# EAGLE schematic master-v1.1 (EAGLE 6.2)

## Sheet 1 of 7
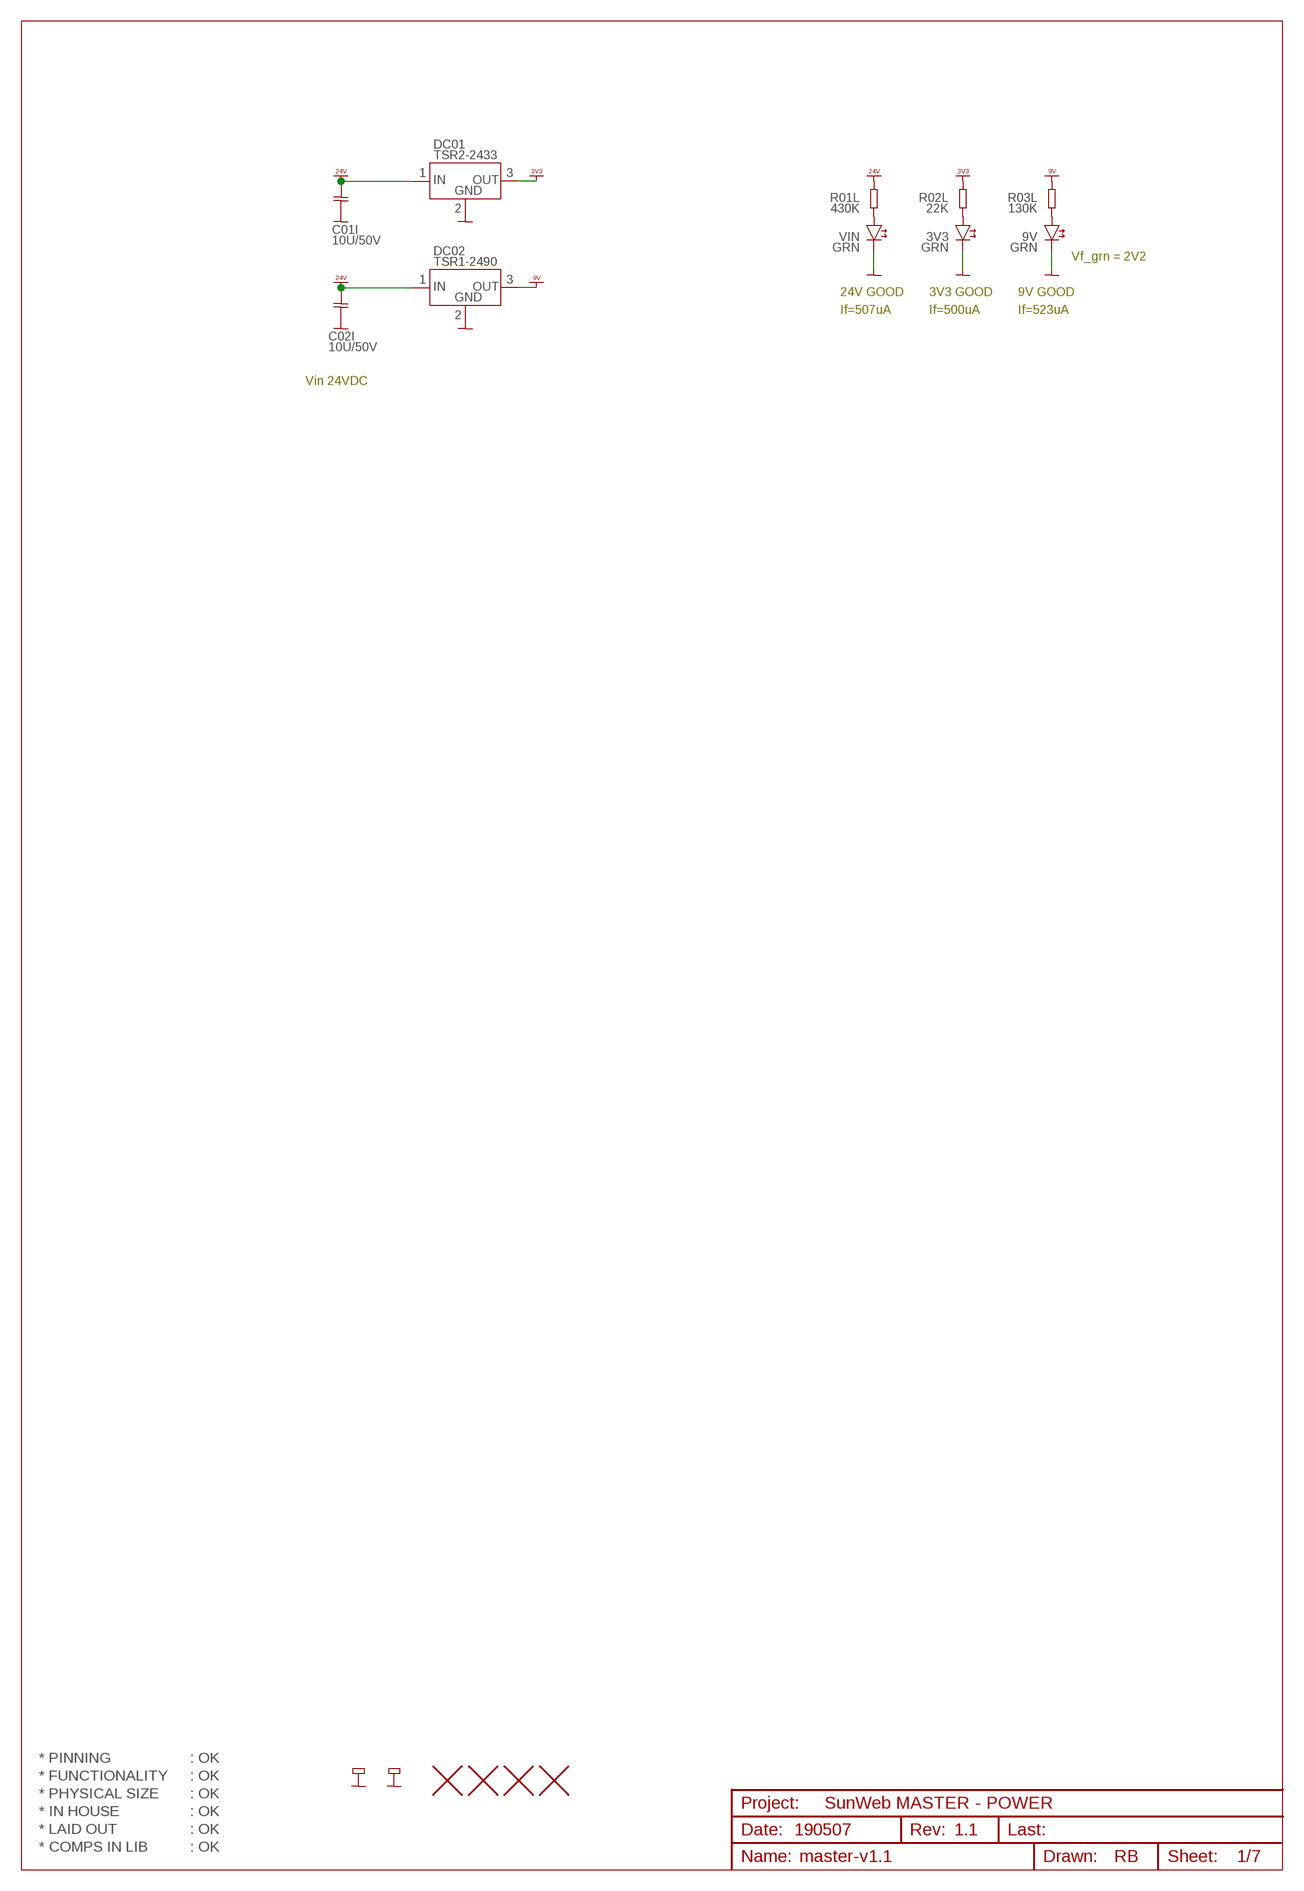
[diagram p0: schematic, sheet 1]

### Parts
3V3  GRN  LED_SMD_0603  [LED_SMD_0603]
9V  GRN  LED_SMD_0603  [LED_SMD_0603]
C01I  10U/50V  CAP1210  [CAP1210]
C02I  10U/50V  CAP1210  [CAP1210]
DC01  TSR2-2433  [TSR2-2433]
DC02  TSR1-2490  [TSR1-2490]
H1  HOLE_NPTH_3.2MM  [HOLE_NPTH_3.2MM]
H2  HOLE_NPTH_3.2MM  [HOLE_NPTH_3.2MM]
H3  HOLE_NPTH_3.2MM  [HOLE_NPTH_3.2MM]
H4  HOLE_NPTH_3.2MM  [HOLE_NPTH_3.2MM]
R01L  430K  RES0603  [RES0603]
R02L  22K  RES0603  [RES0603]
R03L  130K  RES0603  [RES0603]
TP1  PIN_GND  [HOLE_PTH_1.8MM_SQR]
TP2  PIN_GND  [HOLE_PTH_1.8MM_SQR]
VIN  GRN  LED_SMD_0603  [LED_SMD_0603]

### Nets
GND: 3V3.C 9V.C C01I.2 C02I.2 DC01.2(2.GND) DC02.2(2.GND) TP1.1 TP2.1 VIN.C ; also sheet 2,3,4,5,6,7
N$12: 9V.A R03L.2
N$28: 3V3.A R02L.2
N$29: R01L.2 VIN.A
VDD_3V3: DC01.3(3.OUT) R02L.1 ; supply symbol labelled VCC_3V3 ; also sheet 2,3,4,5,6,7
VDD_9V: DC02.3(3.OUT) R03L.1 ; supply symbol labelled VCC_9V ; also sheet 6
VDD_24V: C01I.1 C02I.1 DC01.1(1.IN) DC02.1(1.IN) R01L.1 ; supply symbol labelled VCC_24V ; also sheet 3

### Notes on the sheet
- Vf_grn = 2V2
- 24V GOOD | 3V3 GOOD | 9V GOOD
- If=507uA | If=500uA | If=523uA
- Vin 24VDC
- * PINNING | : OK
- * FUNCTIONALITY | : OK
- * PHYSICAL SIZE | : OK
- SunWeb MASTER - POWER
- * IN HOUSE | : OK
- * LAID OUT | : OK | 190507 | 1.1
- * COMPS IN LIB | : OK

## Sheet 2 of 7
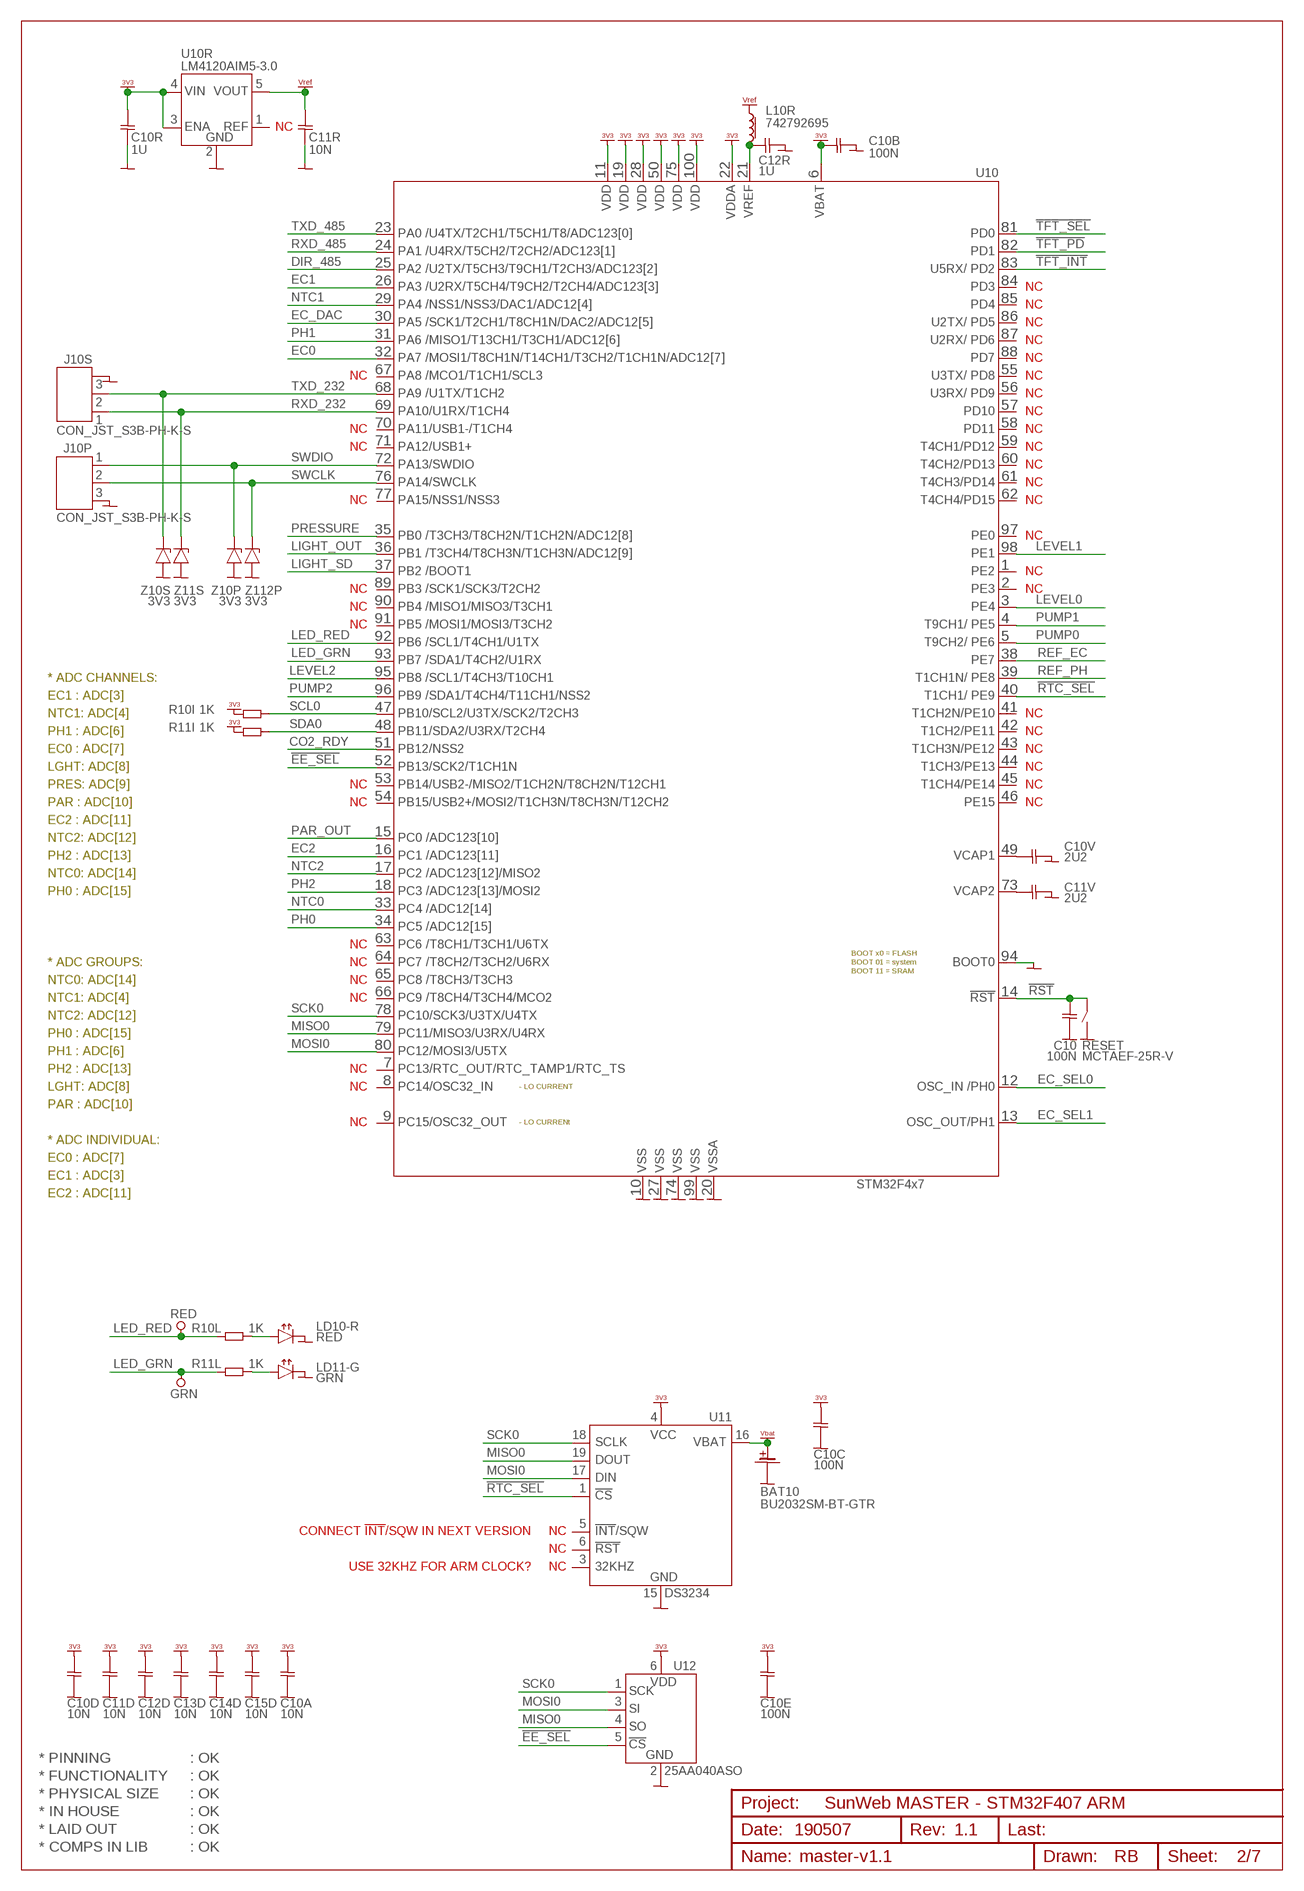
[diagram p1: schematic, sheet 2]

### Parts
BAT10  BU2032SM-BT-GTR  [BU2032SM-BT-GTR]
C10  100N  CAP0603  [CAP0603]
C10A  10N  CAP0603  [CAP0603]
C10B  100N  CAP0603  [CAP0603]
C10C  100N  CAP0603  [CAP0603]
C10D  10N  CAP0603  [CAP0603]
C10E  100N  CAP0603  [CAP0603]
C10R  1U  CAP0603  [CAP0603]
C10V  2U2  CAP0603  [CAP0603]
C11D  10N  CAP0603  [CAP0603]
C11R  10N  CAP0603  [CAP0603]
C11V  2U2  CAP0603  [CAP0603]
C12D  10N  CAP0603  [CAP0603]
C12R  1U  CAP0603  [CAP0603]
C13D  10N  CAP0603  [CAP0603]
C14D  10N  CAP0603  [CAP0603]
C15D  10N  CAP0603  [CAP0603]
GRN  PIN_TEST  [HOLE_PTH_0.8MM]
J10P  CON_JST_S3B-PH-K-S  [CON_JST_S3B-PH-K-S]
J10S  CON_JST_S3B-PH-K-S  [CON_JST_S3B-PH-K-S]
L10R  742792695  L_0603  [L_0603]
LD10-R  RED  LED_SMD_0603  [LED_SMD_0603]
LD11-G  GRN  LED_SMD_0603  [LED_SMD_0603]
R10I  1K  RES0603  [RES0603]
R10L  1K  RES0603  [RES0603]
R11I  1K  RES0603  [RES0603]
R11L  1K  RES0603  [RES0603]
RED  PIN_TEST  [HOLE_PTH_0.8MM]
RESET  MCTAEF-25R-V  SWITCH_PUSHBUTTON  [SWITCH_SMD_PBUTTON_2P]
U10  STM32F407VG  [LQFP100]
U10R  LM4120AIM5-3.0  [SOT23-5]
U11  DS3234  [SO20W]
U12  25AA040ASO  [SOT23-6]
Z10P  3V3  ZENER_SOD80  [ZENER_SOD80]
Z10S  3V3  ZENER_SOD80  [ZENER_SOD80]
Z11S  3V3  ZENER_SOD80  [ZENER_SOD80]
Z112P  3V3  ZENER_SOD80  [ZENER_SOD80]

### Nets
!EE_SEL: U10.52(52.PB13) U12.5(5.!CS)
!RST: C10.1 RESET.2(3-4) U10.14(14.!RST)
!RTC_SEL: U10.40(40.PE9) U11.1(1.CS)
!TFT_INT: U10.83(83.PD2) ; also sheet 3
!TFT_PD: U10.82(82.PD1) ; also sheet 3
!TFT_SEL: U10.81(81.PD0) ; also sheet 3
CO2_RDY: U10.51(51.PB12) ; also sheet 7
DIR_485: U10.25(25.PA2) ; also sheet 3
EC0: U10.32(32.PA7) ; also sheet 4
EC1: U10.26(26.PA3) ; also sheet 4
EC2: U10.16(16.PC1) ; also sheet 4
EC_DAC: U10.30(30.PA5) ; also sheet 4
EC_SEL0: U10.12(12.OSC_IN) ; also sheet 4
EC_SEL1: U10.13(13.OSC_OUT) ; also sheet 4
GND: BAT10.2.- C10.2 C10A.2 C10B.2 C10C.2 C10D.2 C10E.2 C10R.2 C10V.2 C11D.2 C11R.2 C11V.2 C12D.2 C12R.1 C13D.2 C14D.2 C15D.2 J10P.3 J10S.3 LD10-R.C LD11-G.C RESET.1(1-2) U10.10(10.VSS) U10.20(20.VSSA) U10.27(27.VSS) U10.74(74.VSS) U10.94(94.BOOT0) U10.99(99.VSS) U10R.2(2.GND) U11.2(15.GND) U11.7(15.GND) U11.8(15.GND) U11.9(15.GND) U11.10(15.GND) U11.11(15.GND) U11.12(15.GND) U11.13(15.GND) U11.14(15.GND) U11.15(15.GND) U12.2(2.GND) Z10P.1(A) Z10S.1(A) Z11S.1(A) Z112P.1(A) ; also sheet 1,3,4,5,6,7
LED_GRN: GRN.1 R11L.1 U10.93(93.PB7)
LED_RED: R10L.1 RED.1 U10.92(92.PB6)
LEVEL0: U10.3(3.PE4) ; also sheet 6
LEVEL1: U10.98(98.PE1) ; also sheet 6
LEVEL2: U10.95(95.PB8) ; also sheet 6
LIGHT_OUT: U10.36(36.PB1) ; also sheet 7
LIGHT_SD: U10.37(37.PB2) ; also sheet 7
MISO0: U10.79(79.PC11) U11.19(19.DOUT) U12.4(4.SO) ; also sheet 3
MOSI0: U10.80(80.PC12) U11.17(17.DIN) U12.3(3.SI) ; also sheet 3
N$1: C10V.1 U10.49(49.VCAP1)
N$4: C11V.1 U10.73(73.VCAP2)
N$38: LD11-G.A R11L.2
N$39: LD10-R.A R10L.2
NTC0: U10.33(33.PC4) ; also sheet 4
NTC1: U10.29(29.PA4) ; also sheet 4
NTC2: U10.17(17.PC2) ; also sheet 4
PAR_OUT: U10.15(15.PC0) ; also sheet 7
PH0: U10.34(34.PC5) ; also sheet 5
PH1: U10.31(31.PA6) ; also sheet 5
PH2: U10.18(18.PC3) ; also sheet 5
PRESSURE: U10.35(35.PB0) ; also sheet 7
PUMP0: U10.5(5.PE6) ; also sheet 6
PUMP1: U10.4(4.PE5) ; also sheet 6
PUMP2: U10.96(96.PB9) ; also sheet 6
REF_EC: U10.38(38.PE7) ; also sheet 4
REF_PH: U10.39(39.PE8) ; also sheet 5
RXD_232: J10S.1 U10.69(69.PA10) Z11S.2(C)
RXD_485: U10.24(24.PA1) ; also sheet 3
SCK0: U10.78(78.PC10) U11.18(18/20.SCLK) U11.20(18/20.SCLK) U12.1(1.SCK) ; also sheet 3
SCL0: R10I.2 U10.47(47.PB10) ; also sheet 7
SDA0: R11I.2 U10.48(48.PB11) ; also sheet 7
SWCLK: J10P.2 U10.76(76.PA14) Z112P.2(C)
SWDIO: J10P.1 U10.72(72.PA13) Z10P.2(C)
TXD_232: J10S.2 U10.68(68.PA9) Z10S.2(C)
TXD_485: U10.23(23.PA0) ; also sheet 3
VBAT: BAT10.1.+ U11.16(16.VBAT)
VCC_VREF: C11R.1 L10R.1 U10R.5(5.VOUT) ; also sheet 4,7
VDD_3V3: C10A.1 C10B.1 C10C.1 C10D.1 C10E.1 C10R.1 C11D.1 C12D.1 C13D.1 C14D.1 C15D.1 R10I.1 R11I.1 U10.6(6.VBAT) U10.11(11.VDD) U10.19(19.VDD) U10.22(22.VDDA) U10.28(28.VDD) U10.50(50.VDD) U10.75(75.VDD) U10.100(100.VDD) U10R.3(3.ENA) U10R.4(4.VIN) U11.4(4.VCC) U12.6(6.VDD) ; supply symbol labelled VCC_3V3 ; also sheet 1,3,4,5,6,7
VREF1: C12R.2 L10R.2 U10.21(21.VREF+)
Unconnected: U10.1(1.PE2) U10.2(2.PE3) U10.7(7.PC13) U10.8(8.PC14) U10.9(9.PC15) U10.41(41.PE10) U10.42(42.PE11) U10.43(43.PE12) U10.44(44.PE13) U10.45(45.PE14) U10.46(46.PE15) U10.53(53.PB14) U10.54(54.PB15) U10.55(55.PD8) U10.56(56.PD9) U10.57(57.PD10) U10.58(58.PD11) U10.59(59.PD12) U10.60(60.PD13) U10.61(61.PD14) U10.62(62.PD15) U10.63(63.PC6) U10.64(64.PC7) U10.65(65.PC8) U10.66(66.PC9) U10.67(67.PA8) U10.70(70.PA11) U10.71(71.PA12) U10.77(77.PA15) U10.84(84.PD3) U10.85(85.PD4) U10.86(86.PD5) U10.87(87.PD6) U10.88(88.PD7) U10.89(89.PB3) U10.90(90.PB4) U10.91(91.PB5) U10.97(97.PE0) U10R.1(1.REF) U11.3(3.32KHZ) U11.5(5.INT/SQW) U11.6(6.RST)

### Notes on the sheet
- NC
- NC
- NC
- NC
- NC
- NC
- NC | NC
- NC
- NC
- NC | NC
- NC | NC
- NC
- NC
- NC | NC
- NC
- NC
- NC | NC
- NC
- NC
- * ADC CHANNELS:
- EC1 : ADC[3]
- NTC1: ADC[4] | NC
- PH1 : ADC[6] | NC
- EC0 : ADC[7] | NC
- LGHT: ADC[8] | NC
- PRES: ADC[9] | NC | NC
- PAR : ADC[10] | NC | NC
- EC2 : ADC[11]
- NTC2: ADC[12]
- PH2 : ADC[13]
- NTC0: ADC[14]
- PH0 : ADC[15]
- NC
- * ADC GROUPS: | NC
- NTC0: ADC[14] | NC
- NTC1: ADC[4] | NC
- NTC2: ADC[12]
- PH0 : ADC[15]
- PH1 : ADC[6]
- PH2 : ADC[13] | NC
- LGHT: ADC[8] | NC
- PAR : ADC[10]
- NC
- * ADC INDIVIDUAL:
- EC0 : ADC[7]
- EC1 : ADC[3]
- EC2 : ADC[11]
- CONNECT !INT!/SQW IN NEXT VERSION | NC
- NC
- USE 32KHZ FOR ARM CLOCK? | NC
- * PINNING | : OK
- * FUNCTIONALITY | : OK
- * PHYSICAL SIZE | : OK
- SunWeb MASTER - STM32F407 ARM
- * IN HOUSE | : OK
- * LAID OUT | : OK | 190507 | 1.1
- * COMPS IN LIB | : OK

## Sheet 3 of 7
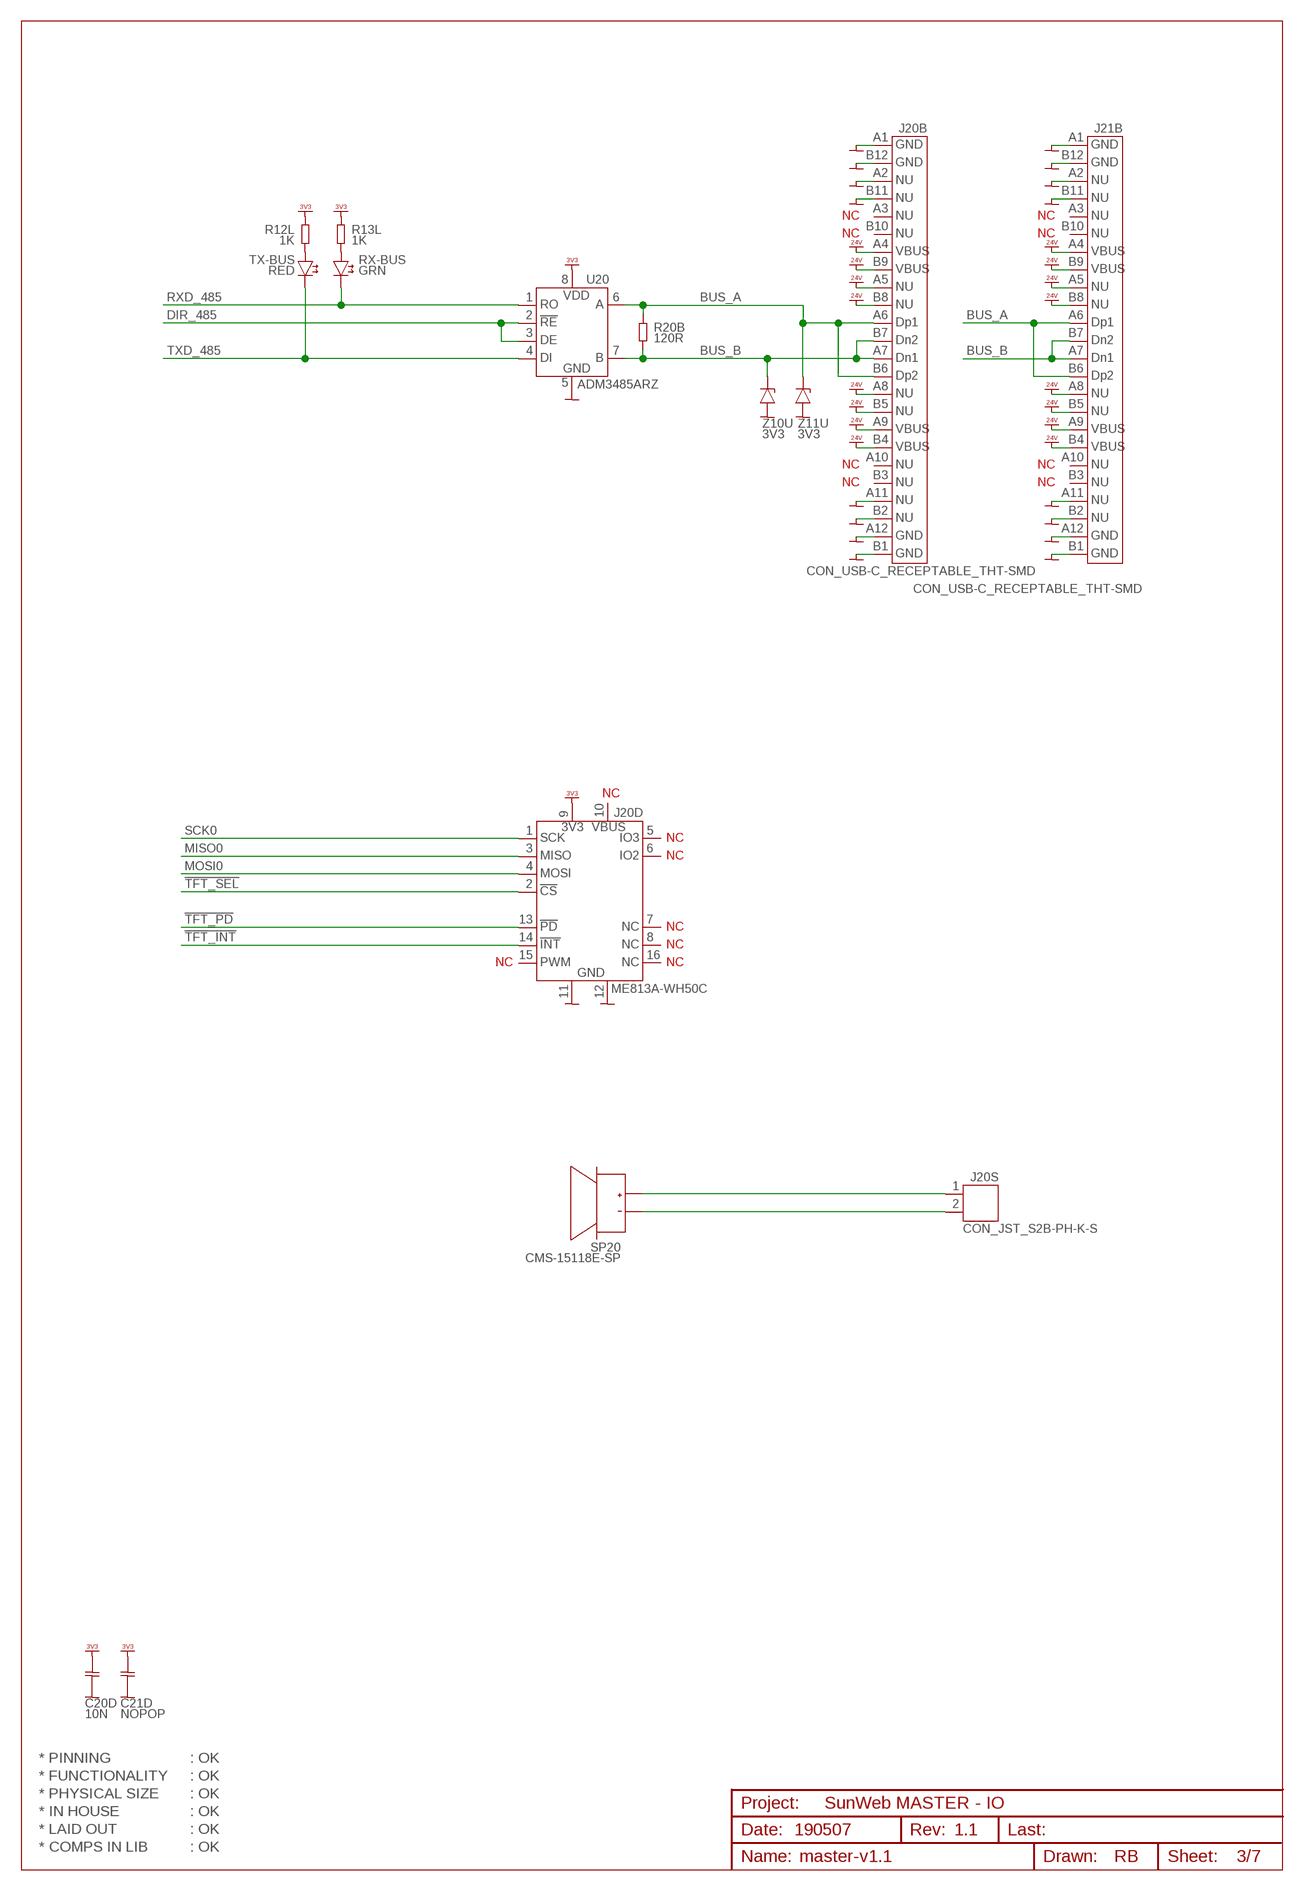
[diagram p2: schematic, sheet 3]

### Parts
C20D  10N  CAP0603  [CAP0603]
C21D  NOPOP  CAP1210  [CAP1210]
J20B  CON_USB-C_RECEPTABLE_THT-SMD  [CON_USB-C_RECEPTABLE_THT-SMD]
J20D  ME813A-WH50C  [ME813A-WH50C]
J20S  CON_JST_S2B-PH-K-S  [CON_JST_S2B-PH-K-S]
J21B  CON_USB-C_RECEPTABLE_THT-SMD  [CON_USB-C_RECEPTABLE_THT-SMD]
R12L  1K  RES0603  [RES0603]
R13L  1K  RES0603  [RES0603]
R20B  120R  RES0603  [RES0603]
RX-BUS  GRN  LED_SMD_0603  [LED_SMD_0603]
SP20  CMS-15118E-SP  [CMS-15118E-SP]
TX-BUS  RED  LED_SMD_0603  [LED_SMD_0603]
U20  ADM3485ARZ  [SO8]
Z10U  3V3  ZENER_SOD80  [ZENER_SOD80]
Z11U  3V3  ZENER_SOD80  [ZENER_SOD80]

### Nets
!TFT_INT: J20D.14(14.!INT) ; also sheet 2
!TFT_PD: J20D.13(13.!PD) ; also sheet 2
!TFT_SEL: J20D.2(2.!CS) ; also sheet 2
BUS_A: J20B.A6(A6.DP1) J20B.B6(B6.DP2) J21B.A6(A6.DP1) J21B.B6(B6.DP2) R20B.1 U20.6(6.A) Z11U.2(C)
BUS_B: J20B.A7(A7.DN1) J20B.B7(B7.DN2) J21B.A7(A7.DN1) J21B.B7(B7.DN2) R20B.2 U20.7(7.B) Z10U.2(C)
DIR_485: U20.2(2.!RE) U20.3(3.DE) ; also sheet 2
GND: C20D.2 C21D.2 J20B.A1(A1.GND) J20B.A2(A2.NU) J20B.A11(A11.NU) J20B.A12(A12.GND) J20B.B1(B1.GND) J20B.B2(B2.NU) J20B.B11(B11.NU) J20B.B12(B12.GND) J20D.11(11.GND) J20D.12(12.GND) J21B.A1(A1.GND) J21B.A2(A2.NU) J21B.A11(A11.NU) J21B.A12(A12.GND) J21B.B1(B1.GND) J21B.B2(B2.NU) J21B.B11(B11.NU) J21B.B12(B12.GND) U20.5(5.GND) Z10U.1(A) Z11U.1(A) ; also sheet 1,2,4,5,6,7
MISO0: J20D.3(3.MISO) ; also sheet 2
MOSI0: J20D.4(4.MOSI) ; also sheet 2
N$21: J20S.1 SP20.+
N$22: J20S.2 SP20.-
N$152: R13L.2 RX-BUS.A
N$153: R12L.2 TX-BUS.A
RXD_485: RX-BUS.C U20.1(1.RO) ; also sheet 2
SCK0: J20D.1(1.SCK) ; also sheet 2
TXD_485: TX-BUS.C U20.4(4.DI) ; also sheet 2
VDD_3V3: C20D.1 C21D.1 J20D.9(9.3V3_IN) R12L.1 R13L.1 U20.8(8.VDD) ; supply symbol labelled VCC_3V3 ; also sheet 1,2,4,5,6,7
VDD_24V: J20B.A4(A4.VBUS) J20B.A5(A5.NU) J20B.A8(A8.NU) J20B.A9(A9.VBUS) J20B.B4(B4.VBUS) J20B.B5(B5.NU) J20B.B8(B8.NU) J20B.B9(B9.VBUS) J21B.A4(A4.VBUS) J21B.A5(A5.NU) J21B.A8(A8.NU) J21B.A9(A9.VBUS) J21B.B4(B4.VBUS) J21B.B5(B5.NU) J21B.B8(B8.NU) J21B.B9(B9.VBUS) ; supply symbol labelled VCC_24V ; also sheet 1
Unconnected: J20B.A3(A3.NU) J20B.A10(A10.NU) J20B.B3(B3.NU) J20B.B10(B10.NU) J20D.5(5.IO3) J20D.6(6.IO2) J20D.7(7.NC) J20D.8(8.NC) J20D.10(10.VBUS) J20D.15(15.PWM) J20D.16(16.NC) J21B.A3(A3.NU) J21B.A10(A10.NU) J21B.B3(B3.NU) J21B.B10(B10.NU)

### Notes on the sheet
- NC | NC
- NC | NC
- NC | NC
- NC | NC
- NC
- NC
- NC
- NC
- NC
- NC | NC
- * PINNING | : OK
- * FUNCTIONALITY | : OK
- * PHYSICAL SIZE | : OK
- SunWeb MASTER - IO
- * IN HOUSE | : OK
- * LAID OUT | : OK | 190507 | 1.1
- * COMPS IN LIB | : OK

## Sheet 4 of 7
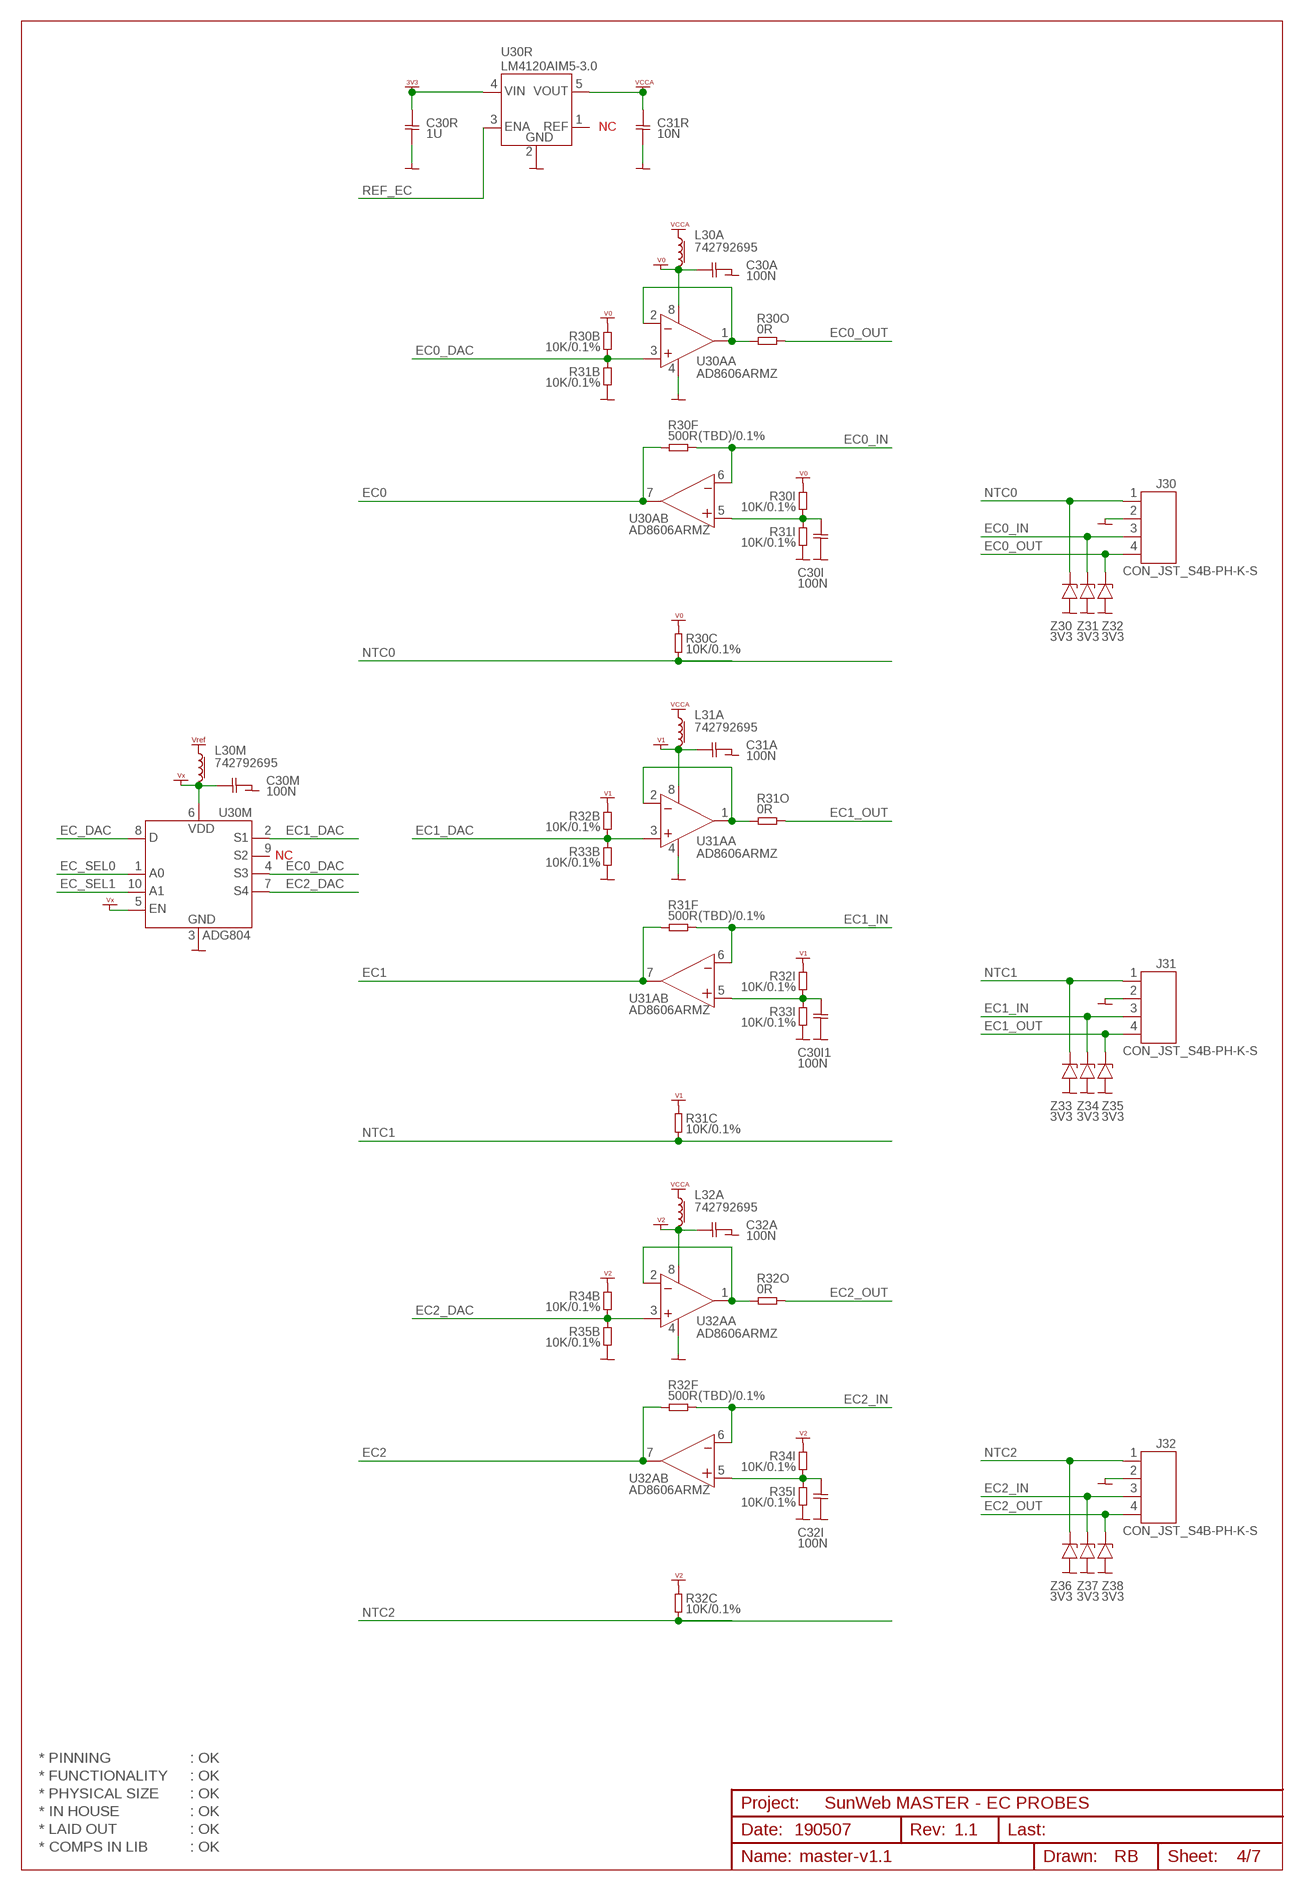
[diagram p3: schematic, sheet 4]

### Parts
C30A  100N  CAP0603  [CAP0603]
C30I  100N  CAP0603  [CAP0603]
C30I1  100N  CAP0603  [CAP0603]
C30M  100N  CAP0603  [CAP0603]
C30R  1U  CAP0603  [CAP0603]
C31A  100N  CAP0603  [CAP0603]
C31R  10N  CAP0603  [CAP0603]
C32A  100N  CAP0603  [CAP0603]
C32I  100N  CAP0603  [CAP0603]
J30  CON_JST_S4B-PH-K-S  [CON_JST_S4B-PH-K-S]
J31  CON_JST_S4B-PH-K-S  [CON_JST_S4B-PH-K-S]
J32  CON_JST_S4B-PH-K-S  [CON_JST_S4B-PH-K-S]
L30A  742792695  L_0603  [L_0603]
L30M  742792695  L_0603  [L_0603]
L31A  742792695  L_0603  [L_0603]
L32A  742792695  L_0603  [L_0603]
R30B  10K/0.1%  RES0603  [RES0603]
R30C  10K/0.1%  RES0603  [RES0603]
R30F  500R(TBD)/0.1%  RES0603  [RES0603]
R30I  10K/0.1%  RES0603  [RES0603]
R30O  0R  RES0603  [RES0603]
R31B  10K/0.1%  RES0603  [RES0603]
R31C  10K/0.1%  RES0603  [RES0603]
R31F  500R(TBD)/0.1%  RES0603  [RES0603]
R31I  10K/0.1%  RES0603  [RES0603]
R31O  0R  RES0603  [RES0603]
R32B  10K/0.1%  RES0603  [RES0603]
R32C  10K/0.1%  RES0603  [RES0603]
R32F  500R(TBD)/0.1%  RES0603  [RES0603]
R32I  10K/0.1%  RES0603  [RES0603]
R32O  0R  RES0603  [RES0603]
R33B  10K/0.1%  RES0603  [RES0603]
R33I  10K/0.1%  RES0603  [RES0603]
R34B  10K/0.1%  RES0603  [RES0603]
R34I  10K/0.1%  RES0603  [RES0603]
R35B  10K/0.1%  RES0603  [RES0603]
R35I  10K/0.1%  RES0603  [RES0603]
U30A  AD8606ARMZ  [MSOP8]
U30M  ADG804  [MSOP10]
U30R  LM4120AIM5-3.0  [SOT23-5]
U31A  AD8606ARMZ  [MSOP8]
U32A  AD8606ARMZ  [MSOP8]
Z30  3V3  ZENER_SOD80  [ZENER_SOD80]
Z31  3V3  ZENER_SOD80  [ZENER_SOD80]
Z32  3V3  ZENER_SOD80  [ZENER_SOD80]
Z33  3V3  ZENER_SOD80  [ZENER_SOD80]
Z34  3V3  ZENER_SOD80  [ZENER_SOD80]
Z35  3V3  ZENER_SOD80  [ZENER_SOD80]
Z36  3V3  ZENER_SOD80  [ZENER_SOD80]
Z37  3V3  ZENER_SOD80  [ZENER_SOD80]
Z38  3V3  ZENER_SOD80  [ZENER_SOD80]

### Nets
EC0: R30F.2 U30A.7(B:7.OUT) ; also sheet 2
EC0_DAC: R30B.2 R31B.1 U30A.3(A:3.IN+) U30M.4(4.S3)
EC0_IN: J30.3 R30F.1 U30A.6(B:6.IN-) Z31.2(C)
EC0_OUT: J30.4 R30O.1 Z32.2(C)
EC1: R31F.2 U31A.7(B:7.OUT) ; also sheet 2
EC1_DAC: R32B.2 R33B.1 U30M.2(2.S1) U31A.3(A:3.IN+)
EC1_IN: J31.3 R31F.1 U31A.6(B:6.IN-) Z34.2(C)
EC1_OUT: J31.4 R31O.1 Z35.2(C)
EC2: R32F.2 U32A.7(B:7.OUT) ; also sheet 2
EC2_DAC: R34B.2 R35B.1 U30M.7(7.S4) U32A.3(A:3.IN+)
EC2_IN: J32.3 R32F.1 U32A.6(B:6.IN-) Z37.2(C)
EC2_OUT: J32.4 R32O.1 Z38.2(C)
EC30_BUF: R30O.2 U30A.1(A:1.OUT) U30A.2(A:2.IN-)
EC30_BUF1: R31O.2 U31A.1(A:1.OUT) U31A.2(A:2.IN-)
EC30_BUF2: R32O.2 U32A.1(A:1.OUT) U32A.2(A:2.IN-)
EC_DAC: U30M.8(8.D) ; also sheet 2
EC_SEL0: U30M.1(1.A0) ; also sheet 2
EC_SEL1: U30M.10(10.A1) ; also sheet 2
GND: C30A.2 C30I1.1 C30I.1 C30M.2 C30R.2 C31A.2 C31R.2 C32A.2 C32I.1 J30.2 J31.2 J32.2 R31B.2 R31I.2 R33B.2 R33I.2 R35B.2 R35I.2 U30A.4(A:4.V-) U30M.3(3.GND) U30R.2(2.GND) U31A.4(A:4.V-) U32A.4(A:4.V-) Z30.1(A) Z31.1(A) Z32.1(A) Z33.1(A) Z34.1(A) Z35.1(A) Z36.1(A) Z37.1(A) Z38.1(A) ; also sheet 1,2,3,5,6,7
N$5: C30I1.2 R32I.2 R33I.1 U31A.5(B:5.IN+)
N$6: C32I.2 R34I.2 R35I.1 U32A.5(B:5.IN+)
N$19: C30I.2 R30I.2 R31I.1 U30A.5(B:5.IN+)
NTC0: J30.1 R30C.2 Z30.2(C) ; also sheet 2
NTC1: J31.1 R31C.2 Z33.2(C) ; also sheet 2
NTC2: J32.1 R32C.2 Z36.2(C) ; also sheet 2
REF_EC: U30R.3(3.ENA) ; also sheet 2
V0: C30A.1 L30A.2 R30B.1 R30C.1 R30I.1 U30A.8(A:8.V+)
V1: C31A.1 L31A.2 R31C.1 R32B.1 R32I.1 U31A.8(A:8.V+)
V2: C32A.1 L32A.2 R32C.1 R34B.1 R34I.1 U32A.8(A:8.V+)
VCC_VREF: L30M.1 ; also sheet 2,7
VCCA: C31R.1 L30A.1 L31A.1 L32A.1 U30R.5(5.VOUT)
VDD_3V3: C30R.1 U30R.4(4.VIN) ; supply symbol labelled VCC_3V3 ; also sheet 1,2,3,5,6,7
VX: C30M.1 L30M.2 U30M.5(5.EN) U30M.6(6.VDD)
Unconnected: U30M.9(9.S2) U30R.1(1.REF)

### Notes on the sheet
- NC
- NC
- * PINNING | : OK
- * FUNCTIONALITY | : OK
- * PHYSICAL SIZE | : OK
- SunWeb MASTER - EC PROBES
- * IN HOUSE | : OK
- * LAID OUT | : OK | 190507 | 1.1
- * COMPS IN LIB | : OK

## Sheet 5 of 7
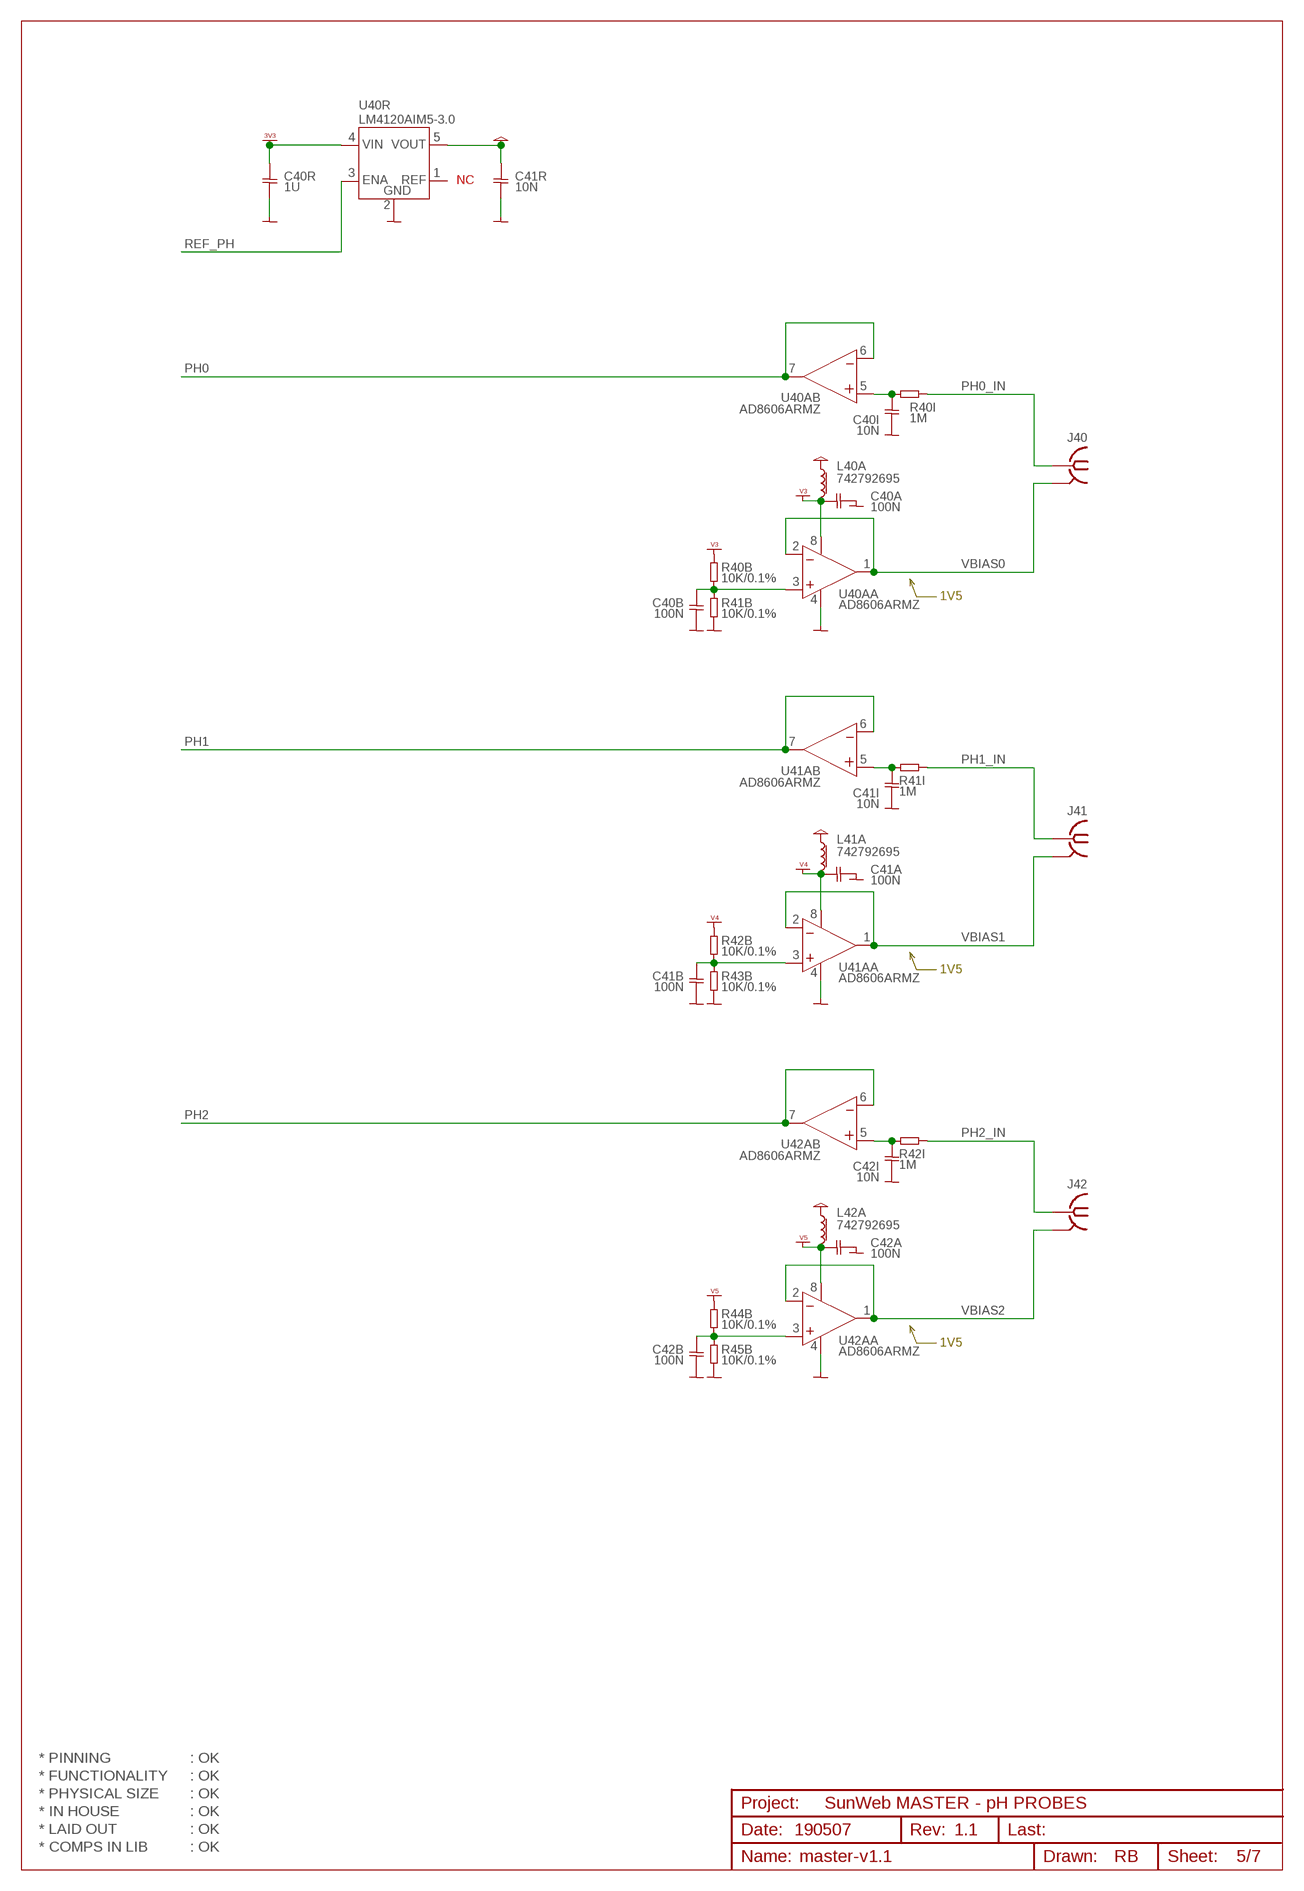
[diagram p4: schematic, sheet 5]

### Parts
C40A  100N  CAP0603  [CAP0603]
C40B  100N  CAP0603  [CAP0603]
C40I  10N  CAP0603  [CAP0603]
C40R  1U  CAP0603  [CAP0603]
C41A  100N  CAP0603  [CAP0603]
C41B  100N  CAP0603  [CAP0603]
C41I  10N  CAP0603  [CAP0603]
C41R  10N  CAP0603  [CAP0603]
C42A  100N  CAP0603  [CAP0603]
C42B  100N  CAP0603  [CAP0603]
C42I  10N  CAP0603  [CAP0603]
J40  CON_SMA_EDGE_PCB_WIDE_4_CPW  [SMA_LAUNCH_WIDE_4LAYER_CPW]
J41  CON_SMA_EDGE_PCB_WIDE_4_CPW  [SMA_LAUNCH_WIDE_4LAYER_CPW]
J42  CON_SMA_EDGE_PCB_WIDE_4_CPW  [SMA_LAUNCH_WIDE_4LAYER_CPW]
L40A  742792695  L_0603  [L_0603]
L41A  742792695  L_0603  [L_0603]
L42A  742792695  L_0603  [L_0603]
R40B  10K/0.1%  RES0603  [RES0603]
R40I  1M  RES0603  [RES0603]
R41B  10K/0.1%  RES0603  [RES0603]
R41I  1M  RES0603  [RES0603]
R42B  10K/0.1%  RES0603  [RES0603]
R42I  1M  RES0603  [RES0603]
R43B  10K/0.1%  RES0603  [RES0603]
R44B  10K/0.1%  RES0603  [RES0603]
R45B  10K/0.1%  RES0603  [RES0603]
U40A  AD8606ARMZ  [MSOP8]
U40R  LM4120AIM5-3.0  [SOT23-5]
U41A  AD8606ARMZ  [MSOP8]
U42A  AD8606ARMZ  [MSOP8]

### Nets
!PH0_OFF: C40B.2 R40B.2 R41B.1 U40A.3(A:3.IN+)
!PH1_OFF: C41B.2 R42B.2 R43B.1 U41A.3(A:3.IN+)
!PH2_OFF: C42B.2 R44B.2 R45B.1 U42A.3(A:3.IN+)
GND: C40A.1 C40B.1 C40I.1 C40R.2 C41A.1 C41B.1 C41I.1 C41R.2 C42A.1 C42B.1 C42I.1 R41B.2 R43B.2 R45B.2 U40A.4(A:4.V-) U40R.2(2.GND) U41A.4(A:4.V-) U42A.4(A:4.V-) ; also sheet 1,2,3,4,6,7
N$9: C41I.2 R41I.2 U41A.5(B:5.IN+)
N$17: C42I.2 R42I.2 U42A.5(B:5.IN+)
N$20: C40I.2 R40I.2 U40A.5(B:5.IN+)
PH0: U40A.6(B:6.IN-) U40A.7(B:7.OUT) ; also sheet 2
PH0_IN: J40.PIN R40I.1
PH1: U41A.6(B:6.IN-) U41A.7(B:7.OUT) ; also sheet 2
PH1_IN: J41.PIN R41I.1
PH2: U42A.6(B:6.IN-) U42A.7(B:7.OUT) ; also sheet 2
PH2_IN: J42.PIN R42I.1
REF_PH: U40R.3(3.ENA) ; also sheet 2
V3: C40A.2 L40A.2 R40B.1 U40A.8(A:8.V+)
V4: C41A.2 L41A.2 R42B.1 U41A.8(A:8.V+)
V5: C42A.2 L42A.2 R44B.1 U42A.8(A:8.V+)
VBIAS0: J40.GND1(GND) J40.GND2(GND) J40.GND3(GND) J40.GND4(GND) J40.GND5(GND) U40A.1(A:1.OUT) U40A.2(A:2.IN-)
VBIAS1: J41.GND1(GND) J41.GND2(GND) J41.GND3(GND) J41.GND4(GND) J41.GND5(GND) U41A.1(A:1.OUT) U41A.2(A:2.IN-)
VBIAS2: J42.GND1(GND) J42.GND2(GND) J42.GND3(GND) J42.GND4(GND) J42.GND5(GND) U42A.1(A:1.OUT) U42A.2(A:2.IN-)
VCC: C41R.1 L40A.1 L41A.1 L42A.1 U40R.5(5.VOUT)
VDD_3V3: C40R.1 U40R.4(4.VIN) ; supply symbol labelled VCC_3V3 ; also sheet 1,2,3,4,6,7
Unconnected: U40R.1(1.REF)

### Notes on the sheet
- NC
- 1V5
- 1V5
- 1V5
- * PINNING | : OK
- * FUNCTIONALITY | : OK
- * PHYSICAL SIZE | : OK
- SunWeb MASTER - pH PROBES
- * IN HOUSE | : OK
- * LAID OUT | : OK | 190507 | 1.1
- * COMPS IN LIB | : OK

## Sheet 6 of 7
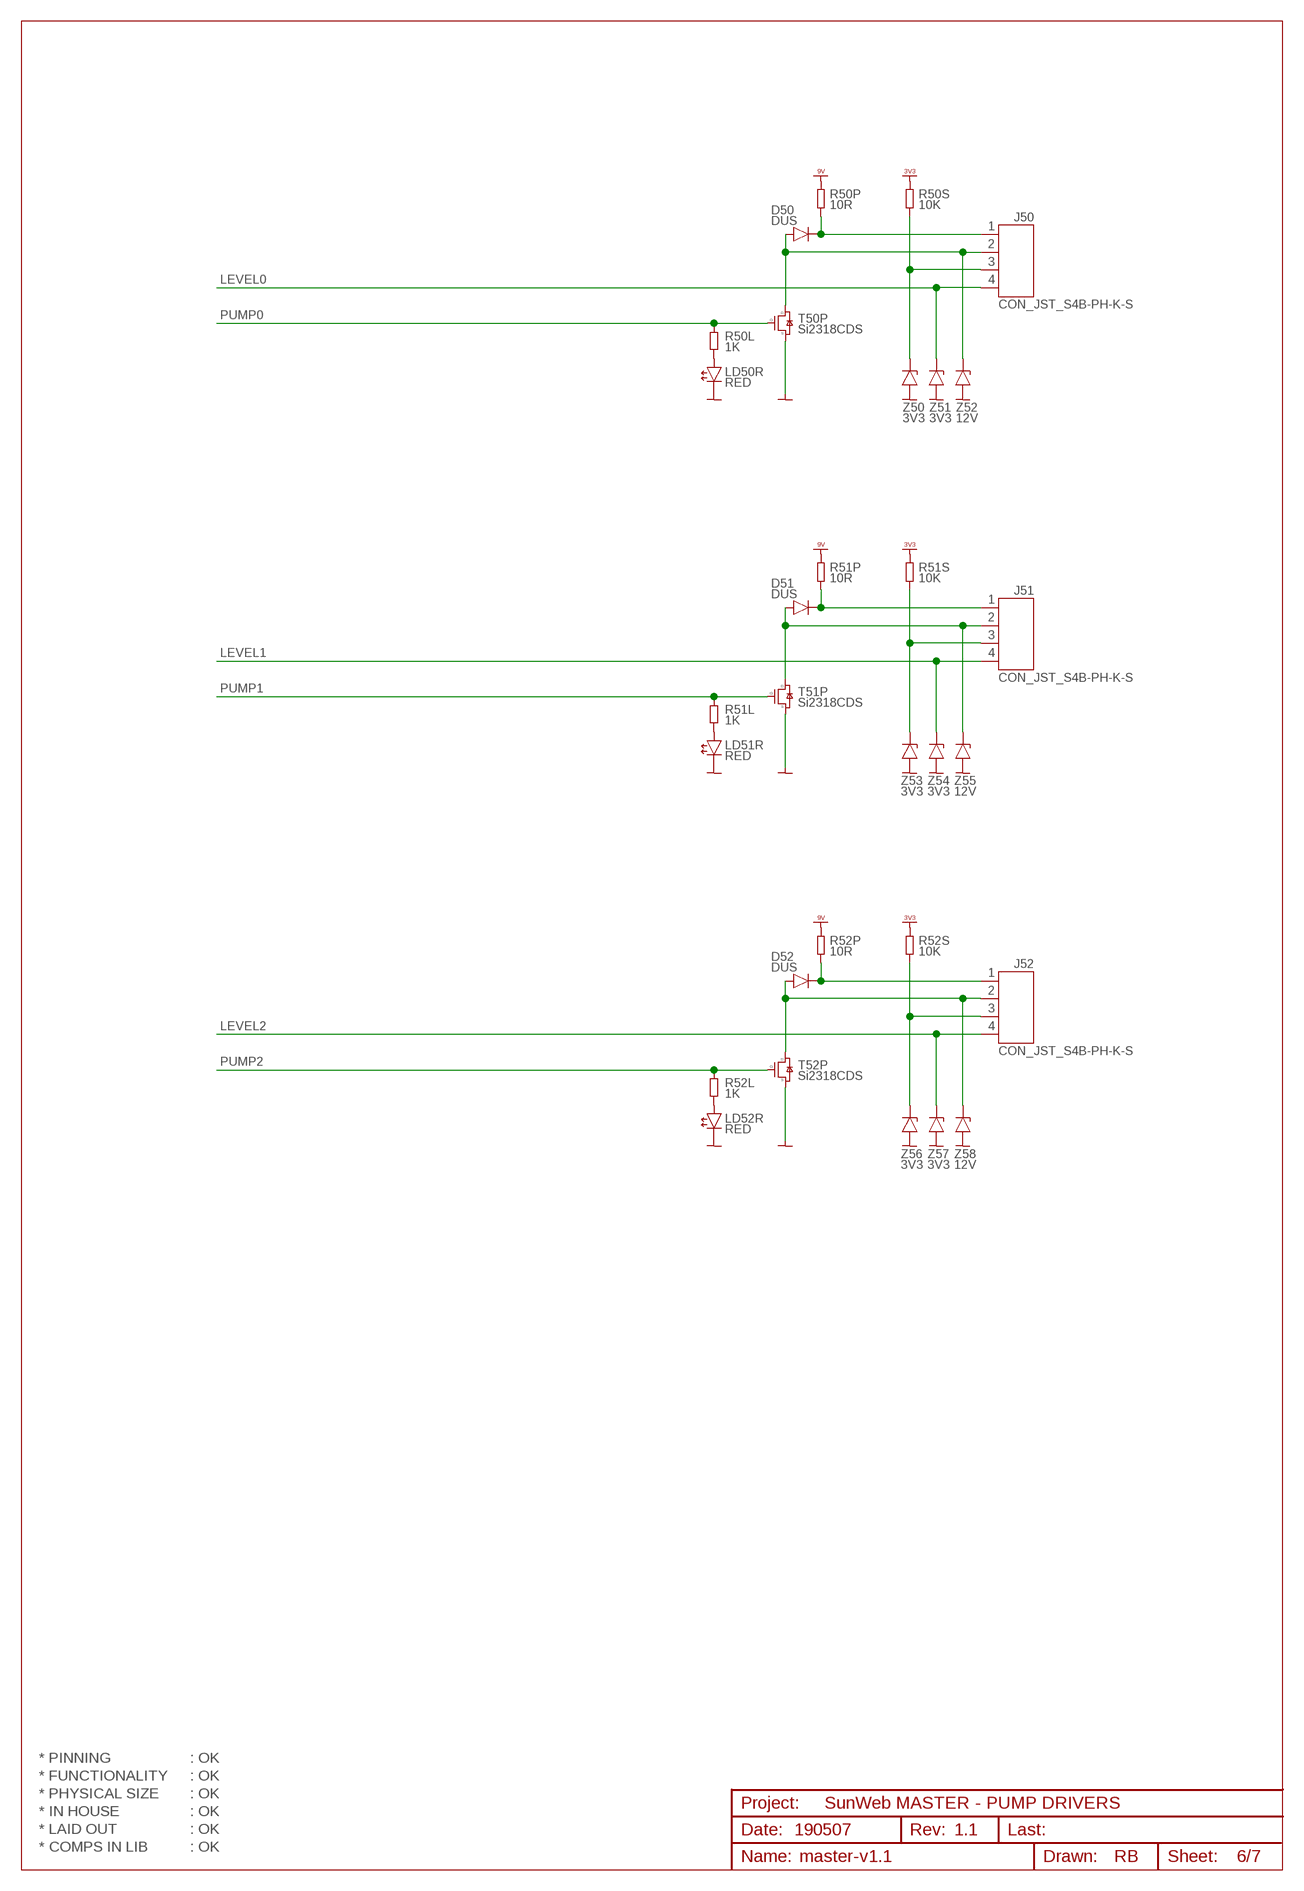
[diagram p5: schematic, sheet 6]

### Parts
D50  DUS  DIODE_1N4148WS  [DIODE_SOD323]
D51  DUS  DIODE_1N4148WS  [DIODE_SOD323]
D52  DUS  DIODE_1N4148WS  [DIODE_SOD323]
J50  CON_JST_S4B-PH-K-S  [CON_JST_S4B-PH-K-S]
J51  CON_JST_S4B-PH-K-S  [CON_JST_S4B-PH-K-S]
J52  CON_JST_S4B-PH-K-S  [CON_JST_S4B-PH-K-S]
LD50R  RED  LED_SMD_0603  [LED_SMD_0603]
LD51R  RED  LED_SMD_0603  [LED_SMD_0603]
LD52R  RED  LED_SMD_0603  [LED_SMD_0603]
R50L  1K  RES0603  [RES0603]
R50P  10R  RES0805  [RES0805]
R50S  10K  RES0603  [RES0603]
R51L  1K  RES0603  [RES0603]
R51P  10R  RES0805  [RES0805]
R51S  10K  RES0603  [RES0603]
R52L  1K  RES0603  [RES0603]
R52P  10R  RES0805  [RES0805]
R52S  10K  RES0603  [RES0603]
T50P  Si2318CDS  NFET_SOT23  [NFET_SOT23]
T51P  Si2318CDS  NFET_SOT23  [NFET_SOT23]
T52P  Si2318CDS  NFET_SOT23  [NFET_SOT23]
Z50  3V3  ZENER_SOD80  [ZENER_SOD80]
Z51  3V3  ZENER_SOD80  [ZENER_SOD80]
Z52  12V  ZENER_SOD80  [ZENER_SOD80]
Z53  3V3  ZENER_SOD80  [ZENER_SOD80]
Z54  3V3  ZENER_SOD80  [ZENER_SOD80]
Z55  12V  ZENER_SOD80  [ZENER_SOD80]
Z56  3V3  ZENER_SOD80  [ZENER_SOD80]
Z57  3V3  ZENER_SOD80  [ZENER_SOD80]
Z58  12V  ZENER_SOD80  [ZENER_SOD80]

### Nets
GND: LD50R.C LD51R.C LD52R.C T50P.2(S2) T51P.2(S2) T52P.2(S2) Z50.1(A) Z51.1(A) Z52.1(A) Z53.1(A) Z54.1(A) Z55.1(A) Z56.1(A) Z57.1(A) Z58.1(A) ; also sheet 1,2,3,4,5,7
LEVEL0: J50.4 Z51.2(C) ; also sheet 2
LEVEL1: J51.4 Z54.2(C) ; also sheet 2
LEVEL2: J52.4 Z57.2(C) ; also sheet 2
N$10: D50.1-(-) J50.1 R50P.2
N$11: D50.2(+) J50.2 T50P.3(D3) Z52.2(C)
N$13: LD51R.A R51L.2
N$14: D51.2(+) J51.2 T51P.3(D3) Z55.2(C)
N$15: J50.3 R50S.2 Z50.2(C)
N$16: D51.1-(-) J51.1 R51P.2
N$18: D52.2(+) J52.2 T52P.3(D3) Z58.2(C)
N$23: J51.3 R51S.2 Z53.2(C)
N$24: LD52R.A R52L.2
N$25: D52.1-(-) J52.1 R52P.2
N$27: J52.3 R52S.2 Z56.2(C)
N$70: LD50R.A R50L.2
PUMP0: R50L.1 T50P.1(G1) ; also sheet 2
PUMP1: R51L.1 T51P.1(G1) ; also sheet 2
PUMP2: R52L.1 T52P.1(G1) ; also sheet 2
VDD_3V3: R50S.1 R51S.1 R52S.1 ; supply symbol labelled VCC_3V3 ; also sheet 1,2,3,4,5,7
VDD_9V: R50P.1 R51P.1 R52P.1 ; supply symbol labelled VCC_9V ; also sheet 1

### Notes on the sheet
- * PINNING | : OK
- * FUNCTIONALITY | : OK
- * PHYSICAL SIZE | : OK
- SunWeb MASTER - PUMP DRIVERS
- * IN HOUSE | : OK
- * LAID OUT | : OK | 190507 | 1.1
- * COMPS IN LIB | : OK

## Sheet 7 of 7
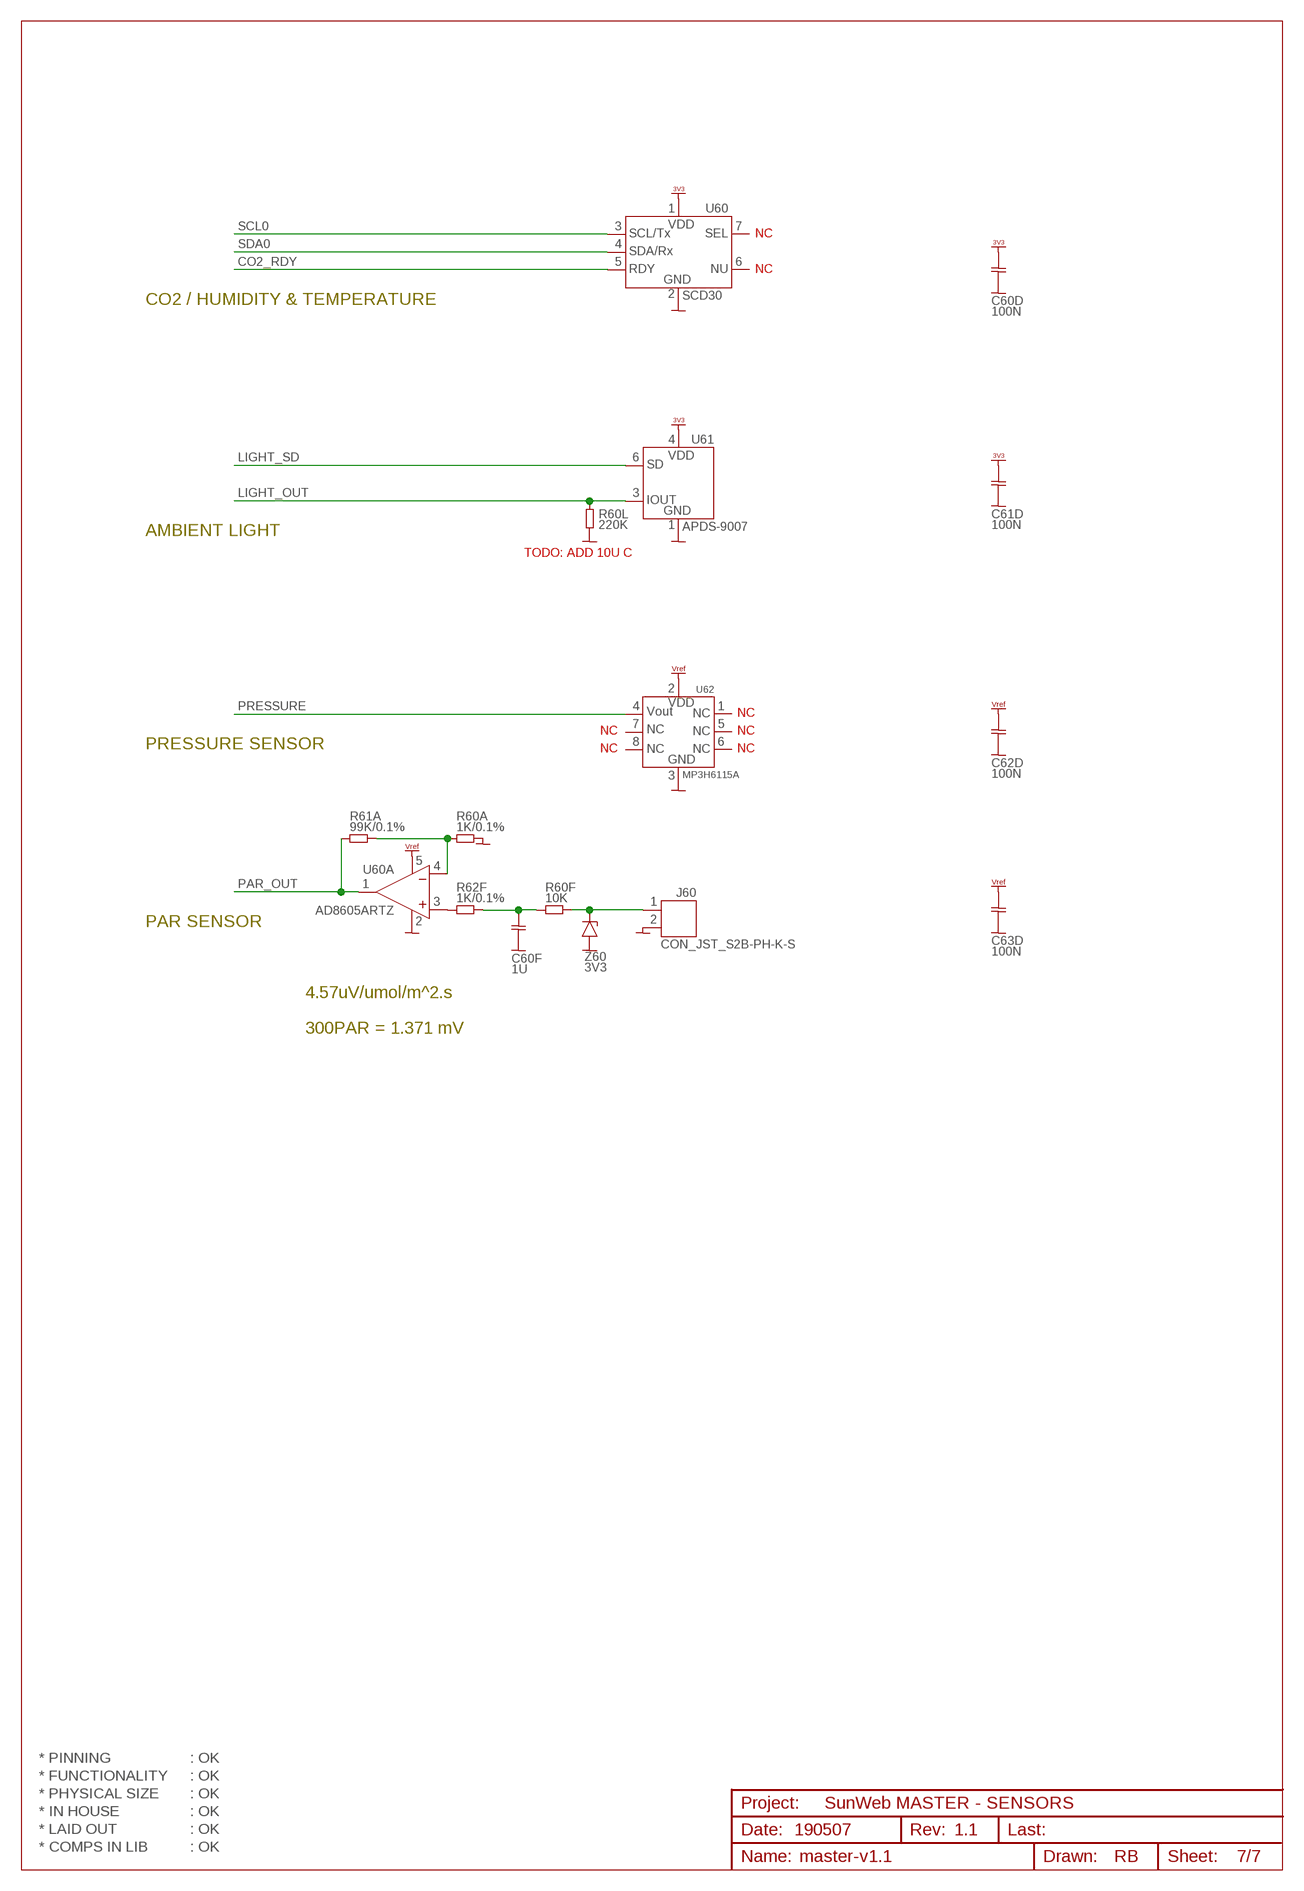
[diagram p6: schematic, sheet 7]

### Parts
C60D  100N  CAP0603  [CAP0603]
C60F  1U  CAP0603  [CAP0603]
C61D  100N  CAP0603  [CAP0603]
C62D  100N  CAP0603  [CAP0603]
C63D  100N  CAP0603  [CAP0603]
J60  CON_JST_S2B-PH-K-S  [CON_JST_S2B-PH-K-S]
R60A  1K/0.1%  RES0603  [RES0603]
R60F  10K  RES0603  [RES0603]
R60L  220K  RES0603  [RES0603]
R61A  99K/0.1%  RES0603  [RES0603]
R62F  1K/0.1%  RES0603  [RES0603]
U60  SCD30  [SCD30]
U60A  AD8605ARTZ  [SOT23-5]
U61  APDS-9007  [APDS-9007]
U62  MP3H6115A  [MP3H6115A]
Z60  3V3  ZENER_SOD80  [ZENER_SOD80]

### Nets
CO2_RDY: U60.5(5.RDY) ; also sheet 2
GND: C60D.2 C60F.2 C61D.2 C62D.2 C63D.2 J60.2 R60A.2 R60L.2 U60.2(2.GND) U60A.2(2.V-) U61.1(1.GND) U62.3(3.GND) Z60.1(A) ; also sheet 1,2,3,4,5,6
LIGHT_OUT: R60L.1 U61.3(3.IOUT) ; also sheet 2
LIGHT_SD: U61.6(6.SD) ; also sheet 2
N$2: J60.1 R60F.2 Z60.2(C)
N$3: C60F.1 R60F.1 R62F.2
N$7: R60A.1 R61A.2 U60A.4(4.IN-)
N$8: R62F.1 U60A.3(3.IN+)
PAR_OUT: R61A.1 U60A.1(1.OUT) ; also sheet 2
PRESSURE: U62.4(4.VOUT) ; also sheet 2
SCL0: U60.3(3.SCL) ; also sheet 2
SDA0: U60.4(4.SDA) ; also sheet 2
VCC_VREF: C62D.1 C63D.1 U60A.5(5.V+) U62.2(2.VDD) ; also sheet 2,4
VDD_3V3: C60D.1 C61D.1 U60.1(1.VDD) U61.4(4.VDD) ; supply symbol labelled VCC_3V3 ; also sheet 1,2,3,4,5,6
Unconnected: U60.6(6.NU) U60.7(7.SEL) U62.1(1.NC) U62.5(5.NC) U62.6(6.NC) U62.7(7.NC) U62.8(8.NC)

### Notes on the sheet
- NC
- NC
- CO2 / HUMIDITY & TEMPERATURE
- AMBIENT LIGHT
- TODO: ADD 10U C
- NC
- NC | NC
- PRESSURE SENSOR | NC | NC
- PAR SENSOR
- 4.57uV/umol/m^2.s
- 300PAR = 1.371 mV
- * PINNING | : OK
- * FUNCTIONALITY | : OK
- * PHYSICAL SIZE | : OK
- SunWeb MASTER - SENSORS
- * IN HOUSE | : OK
- * LAID OUT | : OK | 190507 | 1.1
- * COMPS IN LIB | : OK

## Library data of the parts
3V3 9V LD10-R LD11-G LD50R LD51R LD52R RX-BUS TX-BUS VIN = 00-own_parts:LED_SMD_0603: LED, SMD, 0603
BAT10 = 00-own_parts:BU2032SM-BT-GTR: Battery holder, for 3032 cell, SMD, DK# BU2032SM-BT-GCT-ND
C01I C02I C21D = 00-own_parts:CAP1210: Capacitor, ceramic, 1210
C10 C10A C10B C10C C10D C10E C10R C10V C11D C11R C11V C12D C12R C13D C14D C15D C20D C30A C30I C30I1 C30M C30R C31A C31R C32A C32I C40A C40B C40I C40R C41A C41B C41I C41R C42A C42B C42I C60D C60F C61D C62D C63D = 00-own_parts:CAP0603: Capacitor, ceramic, 0603
D50-D52 = 00-own_parts:DIODE_1N4148WS: Diode, 1N4148WS, high speed, 100V/350mA, SOD323
DC01 = 00-own_parts:TSR2-2433: DC/DC converter, 2A, Vin: 4V75..36V, Vout: 3V3, SIP3
DC02 = 00-own_parts:TSR1-2490: DC/DC converter, 1A, Vin: 12V..36V, Vout: 9V, thru hole, RS#666-4376 / F#169-6322
GRN RED = 00-own_parts:PIN_TEST: Pin, test pad, hole 0.8mm, pad 1.6mm
H1-H4 = 00-own_parts:HOLE_NPTH_3.2MM: Hole, NPTH, 3.2mm
J10P J10S = 00-own_parts:CON_JST_S3B-PH-K-S: Connector, JST, 2.0mm pitch, 3p, side entry
J20B J21B = 00-own_parts:CON_USB-C_RECEPTABLE_THT-SMD: Connector, DB25, male, straight, wirewarp, press nuts, DK#: 2625FA-ND
J20D = 00-own_parts:ME813A-WH50C: Display, 5" 800*480 TFT LCD module, FT813 EVE chip, capacitive touch, audio amplifier, uses BSW-108-04-T-D header (DK# SAM10929-ND)
J20S J60 = 00-own_parts:CON_JST_S2B-PH-K-S: Connector, JST, 2.0mm pitch, 2p, side entry
J30-J32 J50-J52 = 00-own_parts:CON_JST_S4B-PH-K-S: Connector, JST, 2.0mm pitch, 4p, side entry
J40-J42 = 00-own_parts:CON_SMA_EDGE_PCB: Connector, SMA edge, several variants
L10R L30A L30M L31A L32A L40A L41A L42A = 00-own_parts:L_0603: Inductor, 0603, chip ferrite bead
R01L R02L R03L R10I R10L R11I R11L R12L R13L R20B R30B R30C R30F R30I R30O R31B R31C R31F R31I R31O R32B R32C R32F R32I R32O R33B R33I R34B R34I R35B R35I R40B R40I R41B R41I R42B R42I R43B R44B R45B R50L R50P R50S R51L R51P R51S R52L R52P R52S R60A R60F R60L R61A R62F = 00-own_parts:RES
RESET = 00-own_parts:SWITCH_PUSHBUTTON: Switch, push button, SPNO, MCTAEF, F# 160-5485
SP20 = 00-own_parts:CMS-15118E-SP: Speaker, magnet, 0.8W, 11x15mm, SMD
T50P T51P T52P = 00-own_parts:NFET_SOT23: n-FET, generic SOT23
TP1 TP2 = 00-own_parts:PIN_GND
U10 = 00-own_parts:STM32F407VG: MCU, STM32F407VG, ARM Cortex-M4 32-bit MCU+FPU, 210DMIPS, 1MB Flash/192+4KB RAM, USB OTG HS/FS, Ethernet, 17 TIMs, 3 ADCs, 15 comm. interfaces & camera, LQFP100
U10R U30R U40R = 00-own_parts:LM4120AIM5-3.0: Reference, series, with enable, 3V00, SOT23-5
U11 = 00-own_parts:DS3234: RTC, Extremely Accurate RTC, SPI, w. integrated crystal, SRAM, SO20
U12 = 00-own_parts:25AA040A: EEPROM, 4kbit (512 x 8), SPI, 10 Mc, SOT23-6
U20 = 00-own_parts:ADM3485ARZ: Transceiver, RS485/422, 3V3, 10Mbps, SO8, F#127-4167
U30A U31A U32A U40A U41A U42A = 00-own_parts:AD8606ARMZ: OPAMP, dual, single supply, precision low noise rail to rail op-amp, MSOP8, DK# AD8606ARMZ-R7CT-ND
U30M = 00-own_parts:ADG804: Multiplexer, analog mux, 4:1, 1V65..3V6, 0R5, MSOP10
U60 = 00-own_parts:SCD30: Sensor, CO2, humidity & temperature
U60A = 00-own_parts:AD8605ARTZ: OPAMP, 10 MHz, 5 V/µs, 2V7..5V5, SOT23-5, F#237-6717
U61 = 00-own_parts:APDS-9007: Sensor, logaritmic 3..70K lux ambient light, light-to-current converter, F#154-8112
U62 = 00-own_parts:MP3H6115A: Pressure sensor, MP3H611A, 15 to 115 kPa (2.2 to 16.7 psi), 0V12 to 2V8 output, DK# MP3H6115AC6U-ND
Z10P Z10S Z10U Z11S Z11U Z30-Z38 Z50-Z58 Z60 Z112P = 00-own_parts:ZENER_SOD80: Zener, generic SOD80